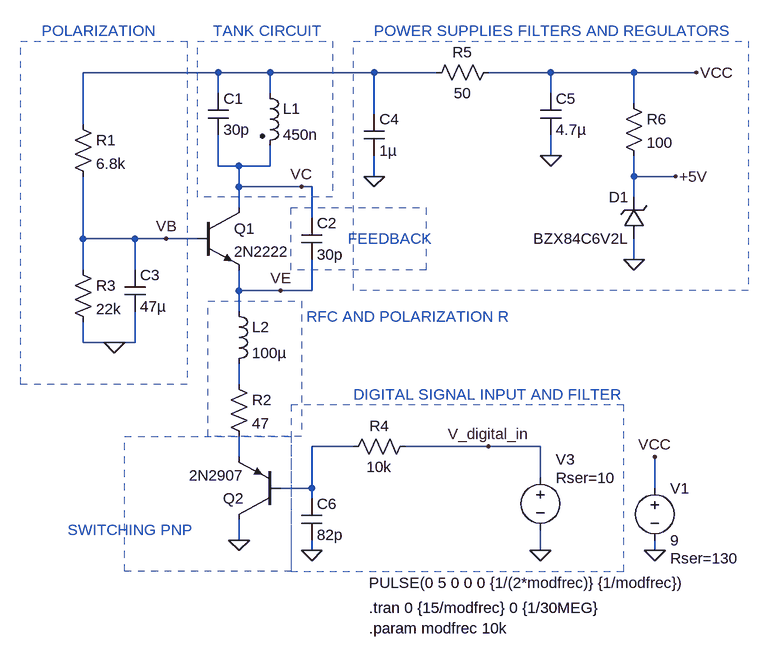
[diagram p0: schematic transmitter.asc]
transmitter.asc, the LTspice schematic file:
Version 4
SHEET 1 1248 920
WIRE 160 48 -48 48
WIRE 240 48 160 48
WIRE 400 48 240 48
WIRE 496 48 400 48
WIRE 672 48 576 48
WIRE 800 48 672 48
WIRE 896 48 800 48
WIRE 160 80 160 48
WIRE 240 80 240 48
WIRE 672 80 672 48
WIRE 800 96 800 48
WIRE 400 112 400 48
WIRE -48 128 -48 48
WIRE 672 176 672 144
WIRE 160 192 160 144
WIRE 192 192 160 192
WIRE 240 192 240 160
WIRE 240 192 192 192
WIRE 400 208 400 176
WIRE 800 208 800 176
WIRE 864 208 800 208
WIRE 192 224 192 192
WIRE 288 224 192 224
WIRE 304 224 288 224
WIRE 800 240 800 208
WIRE 192 256 192 224
WIRE 304 272 304 224
WIRE -48 304 -48 208
WIRE 32 304 -48 304
WIRE 80 304 32 304
WIRE 128 304 80 304
WIRE 800 336 800 304
WIRE -48 352 -48 304
WIRE 32 352 32 304
WIRE 192 384 192 352
WIRE 256 384 192 384
WIRE 304 384 304 336
WIRE 304 384 256 384
WIRE 192 416 192 384
WIRE -48 464 -48 432
WIRE 0 464 -48 464
WIRE 32 464 32 416
WIRE 32 464 0 464
WIRE 192 528 192 496
WIRE 368 624 304 624
WIRE 576 624 448 624
WIRE 656 624 576 624
WIRE 192 640 192 608
WIRE 656 672 656 624
WIRE 304 688 304 624
WIRE 304 688 256 688
WIRE 832 688 832 640
WIRE 304 704 304 688
WIRE 192 768 192 736
WIRE 304 784 304 768
WIRE 656 784 656 752
WIRE 832 784 832 768
FLAG 192 768 0
FLAG 0 464 0
FLAG 832 784 0
FLAG 832 640 VCC
FLAG 896 48 VCC
FLAG 400 208 0
FLAG 656 784 0
FLAG 576 624 V_digital_in
FLAG 80 304 VB
FLAG 256 384 VE
FLAG 672 176 0
FLAG 800 336 0
FLAG 304 784 0
FLAG 288 224 VC
FLAG 864 208 +5V
SYMBOL ind2 224 64 R0
SYMATTR InstName L1
SYMATTR Value 450n
SYMATTR Type ind
SYMBOL cap 144 80 R0
SYMATTR InstName C1
SYMATTR Value 30p
SYMBOL res -64 112 R0
SYMATTR InstName R1
SYMATTR Value 6.8k
SYMBOL npn 128 256 R0
SYMATTR InstName Q1
SYMATTR Value 2N2222
SYMBOL cap 288 272 R0
SYMATTR InstName C2
SYMATTR Value 30p
SYMBOL res 176 512 R0
SYMATTR InstName R2
SYMATTR Value 47
SYMBOL res -64 336 R0
SYMATTR InstName R3
SYMATTR Value 22k
SYMBOL cap 16 352 R0
SYMATTR InstName C3
SYMATTR Value 47µ
SYMBOL voltage 832 672 R0
WINDOW 123 0 0 Left 0
WINDOW 39 24 124 Left 2
SYMATTR SpiceLine Rser=130
SYMATTR InstName V1
SYMATTR Value 9
SYMBOL cap 384 112 R0
SYMATTR InstName C4
SYMATTR Value 1µ
SYMBOL ind 176 400 R0
SYMATTR InstName L2
SYMATTR Value 100µ
SYMBOL res 464 608 R90
WINDOW 0 0 56 VBottom 2
WINDOW 3 32 56 VTop 2
SYMATTR InstName R4
SYMATTR Value 10k
SYMBOL voltage 656 656 R0
WINDOW 3 -264 178 Left 2
WINDOW 123 0 0 Left 0
WINDOW 39 24 16 Left 2
WINDOW 0 24 -12 Left 2
SYMATTR Value PULSE(0 5 0 0 0 {1/(2*modfrec)} {1/modfrec})
SYMATTR SpiceLine Rser=10
SYMATTR InstName V3
SYMBOL res 592 32 R90
WINDOW 0 0 56 VBottom 2
WINDOW 3 32 56 VTop 2
SYMATTR InstName R5
SYMATTR Value 50
SYMBOL cap 656 80 R0
SYMATTR InstName C5
SYMATTR Value 4.7µ
SYMBOL res 784 80 R0
SYMATTR InstName R6
SYMATTR Value 100
SYMBOL zener 816 304 R180
WINDOW 0 24 64 Left 2
WINDOW 3 24 0 Left 2
SYMATTR InstName D1
SYMATTR Value BZX84C6V2L
SYMBOL cap 288 704 R0
SYMATTR InstName C6
SYMATTR Value 82p
SYMBOL pnp 256 736 R180
SYMATTR InstName Q2
SYMATTR Value 2N2907
TEXT 392 872 Left 2 !.tran 0 {15/modfrec} 0 {1/30MEG}
TEXT 392 904 Left 2 !.param modfrec 10k
TEXT 152 -16 Left 2 ;TANK CIRCUIT
TEXT -112 -16 Left 2 ;POLARIZATION
TEXT 400 -16 Left 2 ;POWER SUPPLIES FILTERS AND REGULATORS
TEXT 360 304 Left 2 ;FEEDBACK
TEXT 296 424 Left 2 ;RFC AND POLARIZATION R
TEXT 368 544 Left 2 ;DIGITAL SIGNAL INPUT AND FILTER
TEXT -72 752 Left 2 ;SWITCHING PNP
RECTANGLE Normal 112 528 -144 0 2
RECTANGLE Normal 288 608 144 400 2
RECTANGLE Normal 336 240 128 0 2
RECTANGLE Normal 976 384 368 0 2
RECTANGLE Normal 480 352 272 256 2
RECTANGLE Normal 784 560 272 816 2
RECTANGLE Normal 272 816 16 608 2

The netlist it stands for:
* transmitter.asc
L1 N001 VC 450n
C1 N001 VC 30p
R1 N001 VB 6.8k
Q1 VC VB VE 0 2N2222
C2 VC VE 30p
R2 N002 N004 47
R3 VB 0 22k
C3 VB 0 47µ
V1 VCC 0 9 Rser=130
C4 N001 0 1µ
L2 VE N002 100µ
R4 V_digital_in N003 10k
V3 V_digital_in 0 PULSE(0 5 0 0 0 {1/(2*modfrec)} {1/modfrec}) Rser=10
R5 VCC N001 50
C5 VCC 0 4.7µ
R6 VCC +5V 100
D1 0 +5V BZX84C6V2L
C6 N003 0 82p
Q2 0 N003 N004 0 2N2907
.model D D
.lib standard.dio
.model NPN NPN
.model PNP PNP
.lib standard.bjt
.tran 0 {15/modfrec} 0 {1/30MEG}
.param modfrec 10k
* TANK CIRCUIT
* POLARIZATION
* POWER SUPPLIES FILTERS AND REGULATORS
* FEEDBACK
* RFC AND POLARIZATION R
* DIGITAL SIGNAL INPUT AND FILTER
* SWITCHING PNP
.backanno
.end